# Altium schematic sheet rf.SchDoc: Control Plane
size Letter; Author: Ye-Sheng Kuo; Revision: 2; SheetNumber: 7; SheetTotal: 8
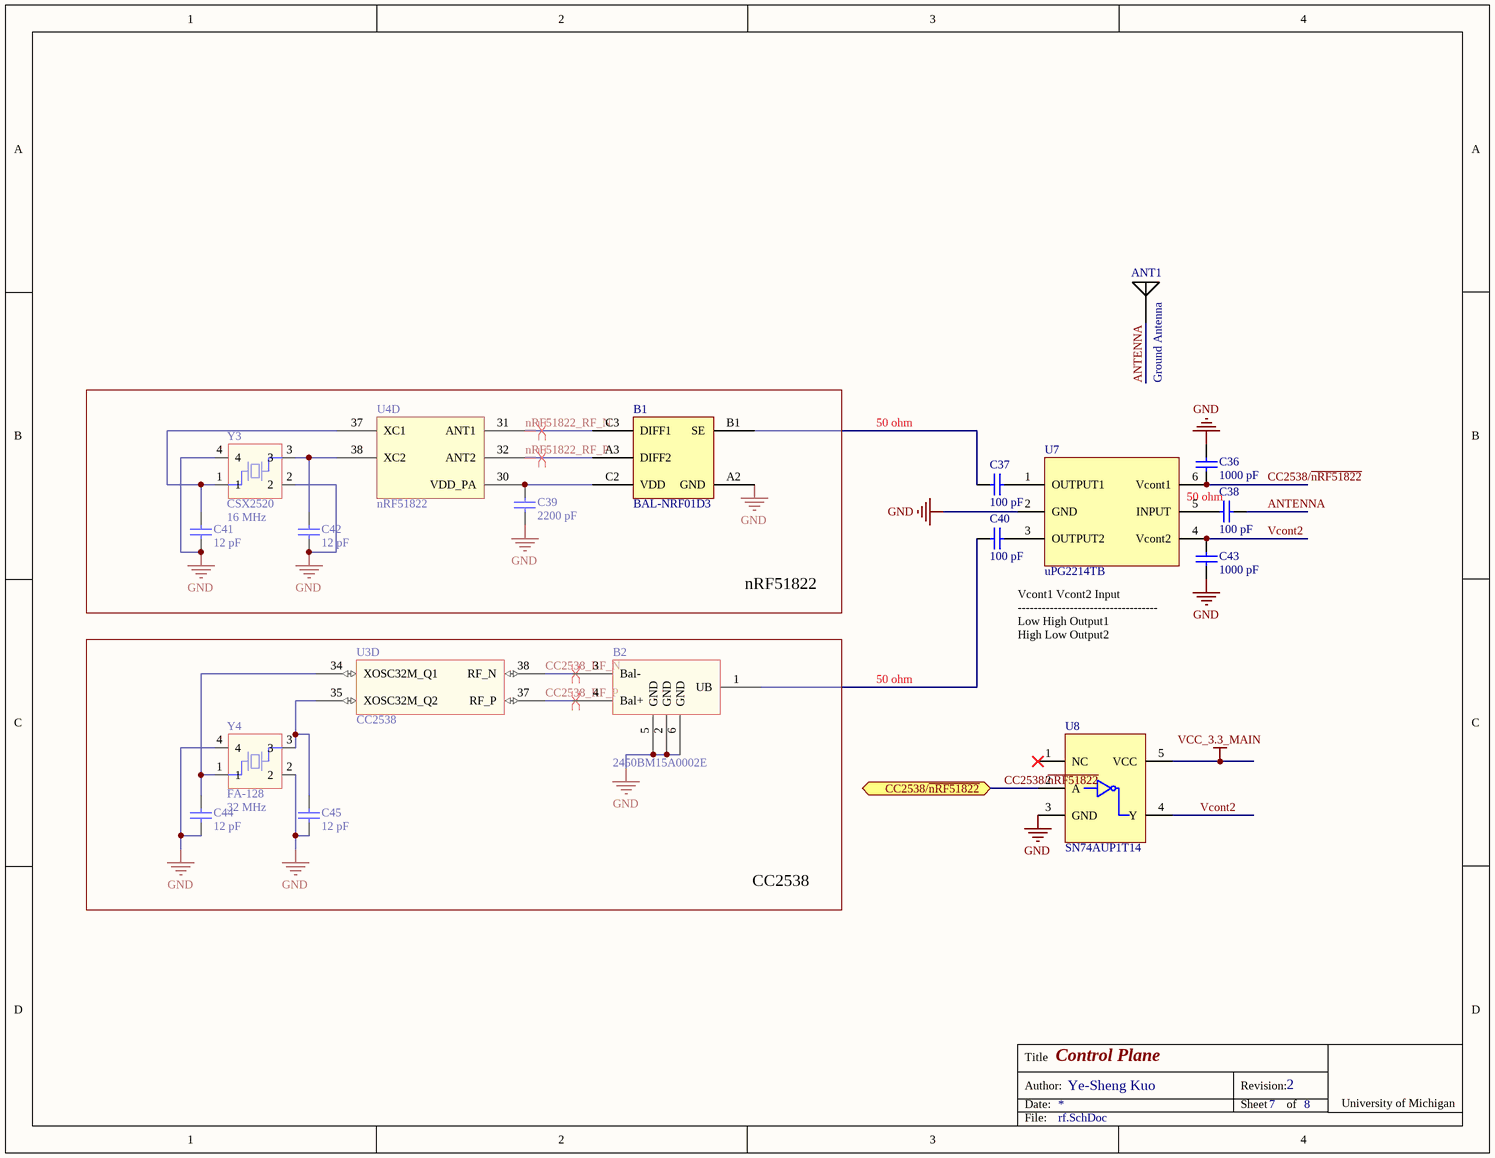
[diagram p0: rf.SchDoc]

## Parts
ANT1  Ground Antenna  [Chip Antenna]
B1  BAL-NRF01D3  [BAL-NRF01D3]
B2  2450BM15A0002E  [2450BM15A0002]
C36  value 1000 pF  [0402]  (hidden comment: Ceramic capacitor)
C37  value 100 pF  [0402]  (hidden comment: Ceramic capacitor)
C38  value 100 pF  [0402]  (hidden comment: Ceramic capacitor)
C39  value 2200 pF  [0402]  (hidden comment: Ceramic capacitor)
C40  value 100 pF  [0402]  (hidden comment: Ceramic capacitor)
C41  value 12 pF  [0402]  (hidden comment: Ceramic capacitor)
C42  value 12 pF  [0402]  (hidden comment: Ceramic capacitor)
C43  value 1000 pF  [0402]  (hidden comment: Ceramic capacitor)
C44  value 12 pF  [0402]  (hidden comment: Ceramic capacitor)
C45  value 12 pF  [0402]  (hidden comment: Ceramic capacitor)
U3  CC2538  [QFN56]  (part D of 6)
U4  nRF51822  [QFN-48]  (part D of 5)
U7  uPG2214TB  [minimold-6]
U8  SN74AUP1T14  [SC-70-5 (DCK)]
Y3  CSX2520  Frequency: 16 MHz  [CX2520]
Y4  FA-128  frequency: 32 MHz  [FA-128]

## Ports
CC2538/~{nRF51822}

## Nets
GND: B1.A2(GND) B2.2(GND) B2.5(GND) B2.6(GND) C36.1 C39.2 C41.1 C42.1 C43.2 C44.1 C45.1 U7.2(GND) U8.3(GND) Y3.2 Y3.4 Y4.2 Y4.4
VCC_3.3_MAIN: U8.5(VCC)
ANTENNA: ANT1.1 C38.2
CC2538/~{nRF51822}: C36.2 U7.6(Vcont1) U8.2(A) ; port CC2538/~{nRF51822}
CC2538_RF_N: B2.3(Bal-) U3.38(RF_N)
CC2538_RF_P: B2.4(Bal+) U3.37(RF_P)
nRF51822_RF_N: B1.C3(DIFF1) U4.31(ANT1)
nRF51822_RF_P: B1.A3(DIFF2) U4.32(ANT2)
Vcont2: C43.1 U7.4(Vcont2) U8.4(Y)
NetB1_B1: B1.B1(SE) C37.1
NetB1_C2: B1.C2(VDD) C39.1 U4.30(VDD_PA)
NetB2_1: B2.1(UB) C40.1
NetC37_2: C37.2 U7.1(OUTPUT1)
NetC38_1: C38.1 U7.5(INPUT)
NetC40_2: C40.2 U7.3(OUTPUT2)
NetC41_2: C41.2 U4.37(XC1) Y3.1
NetC42_2: C42.2 U4.38(XC2) Y3.3
NetC44_2: C44.2 U3.34(XOSC32M_Q1) Y4.1
NetC45_2: C45.2 U3.35(XOSC32M_Q2) Y4.3

Not connected (* = marked no-connect by the designer): U8 1(NC)*

## Layout directives
differential pair: CC2538_RF_N, CC2538_RF_P, nRF51822_RF_N, nRF51822_RF_P

## Notes on the sheet
- 50 ohm
- nRF51822
- (near C43) Vcont1	Vcont2	Input
  -----------------------------------
  Low	High	Output1
  High	Low	Output2
- CC2538
- Title
- Date:
- Author:
- Revision:
- Sheet
- of
- University of Michigan
- File:

## Library data of the parts
ANT1 = Ground Antenna: 2.4GHz Surface Mount Device (SMD) On Ground Antenna, 50 Ohms; Supplier 1: RichardsonRFPD; Supplier Part Number 1: FR05-S1-N-0102B
B1 = BAL-NRF01D3: 50 ohm nominal input / conjugate match balun to nRF51822-CEAA; Supplier 1: Digi-Key; Supplier Part Number 1: 497-13637-1-ND
B2 = 2450BM15A0002E: 2.45 GHz Balun for TI CC253X; Supplier 1: Digi-Key; Supplier Part Number 1: 712-1536-1-ND
C36 C43 = C_1000p_50V_0402_ceramic: Ceramic capacitor, 1000 pF, 0402 package; Manufacture: TDK; voltage rated: 50 V; tolerance: 10%; package: 0402; Supplier 1: Digi-Key; Supplier Part Number 1: 445-6846-1-ND
C37 C38 C40 = C_100p_25V_0402_ceramic: Ceramic capacitor, 100 pF, 0402 package; Manufacture: Kemet; voltage rated: 25 V; tolerance: 1%; package: 0402; Supplier 1: Digi-Key; Supplier Part Number 1: 399-11246-1-ND
C39 = C_2200p_50V_0402_ceramic: Ceramic capacitor, 2200 pF, 0402 package; Manufacture: TDK; voltage rated: 50 V; tolerance: 10%; Temperature Coefficient: X7R; package: 0402; Supplier 1: Digi-Key; Supplier Part Number 1: 445-1257-1-ND
C41 C42 C44 C45 = C_12p_0402_ceramic: Ceramic capacitor, 12 pF, 0402 package; Manufacture: Johanson; voltage rated: 50 V; tolerance: 2%; package: 0402; Supplier 1: Digi-Key; Supplier Part Number 1: 712-1256-1-ND
U3 = CC2538: A Powerful System-On-Chip for 2.4-GHz IEEE 802.15.4, 6LoWPAN  and ZigBee Applications; Supplier 1: Digi-Key; Supplier Part Number 1: 296-35797-1-ND
U4 = nRF51822: Multiprotocol Bluetooth® low energy/2.4 GHz RF System on Chip; Supplier 1: Digi-Key; Supplier Part Number 1: 1490-1032-1-ND
U7 = uPG2214TB: GaAs Integrated Circuit for L, S-Band SPDT Switch; Supplier 1: Digi-Key; Supplier Part Number 1: UPG2214TB-E4-ACT-ND
U8 = SN74AUP1T14: LOW POWER, 1.8/2.5/3.3-V INPUT, 3.3-V CMOS OUTPUT, SINGLE  SCHMITT-TRIGGER INVERTER GATE; Supplier 1: Digi-Key; Supplier Part Number 1: 296-27392-1-ND
Y3 = CSX2520: Crystal oscillator; Load capacitance: 8 pF; Frequency stability: 15 ppm; Frequency tolerance: 10 ppm; ESR: 80 ohm; Supplier 1: Digi-Key; Supplier Part Number 1: 1253-1121-1-ND
Y4 = FA-128: MHz Range Crystal Unit; Load capatance: 10 pF; ESR: 60; stability: 20 ppm; Supplier 1: Digi-Key; Supplier Part Number 1: SER3800CT-ND